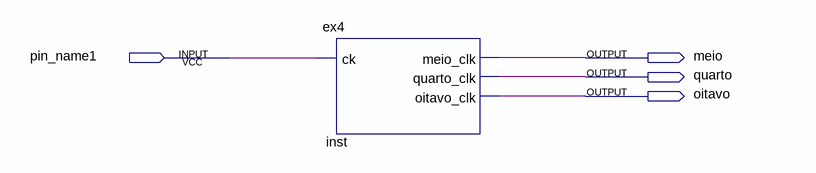
[diagram p0: schematic sheet]
// Quartus schematic Block1.bdf as structural Verilog: 1 symbols, 4 pins
module Block1 (
  input  pin_name1,
  output meio,
  output quarto,
  output oitavo
);

  ex4 inst (.ck(pin_name1), .meio_clk(meio), .quarto_clk(quarto), .oitavo_clk(oitavo));
endmodule
